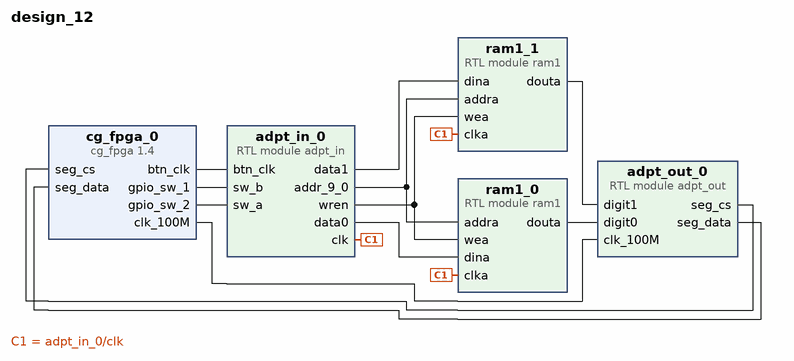
[diagram p0: block diagram of the top level]
# Vivado block design design_12, xc7z020clg400-1, Vivado 2024.2
create_bd_design design_12

create_bd_cell -type ip -vlnv educg.net:user:cg_fpga:1.4 cg_fpga_0
create_bd_cell -type module -reference adpt_in adpt_in_0
create_bd_cell -type module -reference adpt_out adpt_out_0
create_bd_cell -type module -reference ram1 ram1_0
create_bd_cell -type module -reference ram1 ram1_1

# ---- connections ----

connect_bd_net [get_bd_pins adpt_in_0/addr_9_0] [get_bd_pins ram1_0/addra] [get_bd_pins ram1_1/addra]
connect_bd_net [get_bd_pins adpt_in_0/clk] [get_bd_pins ram1_0/clka] [get_bd_pins ram1_1/clka]
connect_bd_net [get_bd_pins adpt_in_0/data0] [get_bd_pins ram1_0/dina]
connect_bd_net [get_bd_pins adpt_in_0/data1] [get_bd_pins ram1_1/dina]
connect_bd_net [get_bd_pins adpt_in_0/wren] [get_bd_pins ram1_0/wea] [get_bd_pins ram1_1/wea]
connect_bd_net [get_bd_pins adpt_out_0/seg_cs] [get_bd_pins cg_fpga_0/seg_cs]
connect_bd_net [get_bd_pins adpt_out_0/seg_data] [get_bd_pins cg_fpga_0/seg_data]
connect_bd_net [get_bd_pins cg_fpga_0/btn_clk] [get_bd_pins adpt_in_0/btn_clk]
connect_bd_net [get_bd_pins cg_fpga_0/clk_100M] [get_bd_pins adpt_out_0/clk_100M]
connect_bd_net [get_bd_pins cg_fpga_0/gpio_sw_1] [get_bd_pins adpt_in_0/sw_b]
connect_bd_net [get_bd_pins cg_fpga_0/gpio_sw_2] [get_bd_pins adpt_in_0/sw_a]
connect_bd_net [get_bd_pins ram1_0/douta] [get_bd_pins adpt_out_0/digit0]
connect_bd_net [get_bd_pins ram1_1/douta] [get_bd_pins adpt_out_0/digit1]

validate_bd_design
save_bd_design
